# Altium schematic sheet QPL9547.SchDoc
size A4; Organization: Altium Limited; Address1: L3, 12a Rodborough Rd; Address2: Frenchs Forest; Address3: NSW; Address4: Australia 2086; DocumentNumber: 6; SheetNumber: 6; SheetTotal: 7
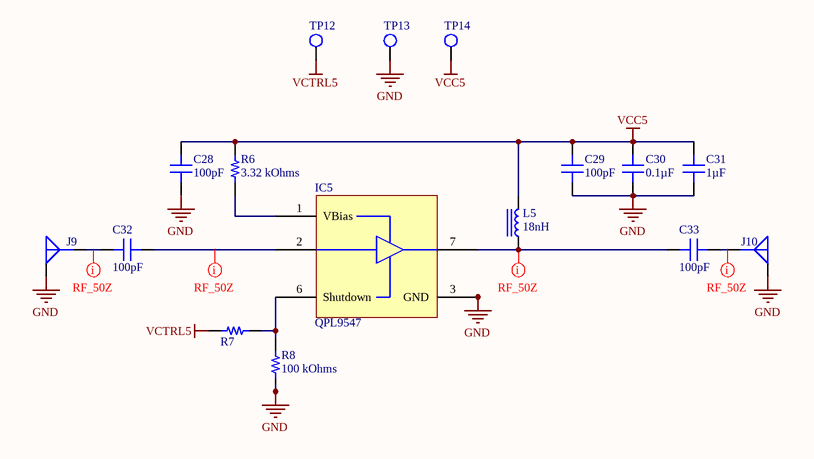
[diagram p0: QPL9547.SchDoc]

## Parts
C28  100pF  [CAP 0402_1005]
C29  100pF  [CAP 0402_1005]
C30  0.1µF  [CAP 0402_1005]
C31  1µF  [CAP 0402_1005]
C32  100pF  [CAP 0402_1005]
C33  100pF  [CAP 0402_1005]
IC5  QPL9547  [Qorvo LNA DFN-8 2X2]
J9  CON-SMA-EDGE-S  [CON-SMA-EDGE-S]  (value not drawn)
J10  CON-SMA-EDGE-S  [CON-SMA-EDGE-S]  (value not drawn)
L5  18nH  [0402CS]
R6  3.32 kOhms  [RES 0402_1005]
R7  (no value)  [RES 0402_1005]
R8  100 kOhms  [RES 0402_1005]
TP12  Test Point-THM  [KEYSTONE-THM-TestPoint]  (value not drawn)
TP13  Test Point-THM  [KEYSTONE-THM-TestPoint]  (value not drawn)
TP14  Test Point-THM  [KEYSTONE-THM-TestPoint]  (value not drawn)

## Nets
GND: C28.1 C29.1 C30.1 C31.1 IC5.3(GND) IC5.4(GND) IC5.5(GND) IC5.8(GND) IC5.9(GND) J9.2(G) J10.2(G) R8.1 TP13.1(TP)
VCC5: C28.2 C29.2 C30.2 C31.2 L5.2 R6.2 TP14.1(TP)
VCTRL5: R7.1 TP12.1(TP)
NetC32_1: C32.1 J9.1(S)
NetC32_2: C32.2 IC5.2(IN)
NetC33_1: C33.1 IC5.7(OUT) L5.1
NetC33_2: C33.2 J10.1(S)
NetIC5_1: IC5.1(VBias) R6.1
NetIC5_6: IC5.6(Shutdown) R7.2 R8.2

## Layout directives
net class RF_50Z: NetC32_1, NetC32_2, NetC33_1, NetC33_2

## Notes on the sheet
- Title
- Author:
- Murat Kucukyilmaz
- Number:
- Date:
- Sheet
- of

## Library data of the parts
C28 C29 C32 C33 = GCM1555C1H101FA16D: CAP CER 100PF 50V C0G/NP0 0402; Manufacturer: Murata Electronics; Temperature Coefficient: C0G, NP0; Tolerance: ±1%; Part Number: GCM1555C1H101FA16D; Value: 100pF; Applications: Automotive; Capacitance: 100pF; ComponentLink1Description: Datasheet; ComponentLink1URL: https://search.murata.co.jp/Ceramy/image/img/A01X/G101/ENG/GCM1555C1H101FA16-01.pdf; ComponentLink2Description: DigiKey Link; ComponentLink2URL: http://digikey.com/product-detail/en/murata-electronics/GCM1555C1H101FA16D/490-14349-1-ND/6606810; Device Package: 0402 (1005 Metric); LastUpdated: 2.09.2020 01:02:12; Lifecycle Status: Active; Minimum Order: 1; Mounting Type: Surface Mount, MLCC; Operating Temperature: -55°C ~ 125°C; Package / Case: 0402 (1005 Metric); Packaging: TapeAndReel; PartId: 7484; Part Status: Active; Price: 0.02; Ratings: AEC-Q200; Series: GCM; Size / Dimension: 0.039" L x 0.020" W (1.00mm x 0.50mm); Supplier 1: DigiKey; Supplier Part Number 1: 490-14349-1-ND; Thickness (Max): 0.022" (0.55mm); Voltage - Rated: 50V
C30 = EMK105B7104KV-F: CAP CER 0.1UF 16V X7R 0402; Manufacturer: Taiyo Yuden; Tolerance: ±10%; Part Number: EMK105B7104KV-F; Value: 0.1µF; Applications: General Purpose; Capacitance: 0.1µF; ComponentLink1Description: Datasheet; ComponentLink1URL: https://ds.yuden.co.jp/TYCOMPAS/ut/detail?pn=EMK105B7104KV-F  &u=M; ComponentLink2Description: DigiKey Link; ComponentLink2URL: http://digikey.com/product-detail/en/taiyo-yuden/EMK105B7104KV-F/587-1451-1-ND/1004082; Device Package: 0402 (1005 Metric); LastUpdated: 2.09.2020 01:02:15; Lifecycle Status: Active; Minimum Order: 1; Mounting Type: Surface Mount, MLCC; Operating Temperature: -55°C ~ 125°C; Package / Case: 0402 (1005 Metric); Packaging: CutTape; PartId: 6070; Part Status: Active; Price: 0.10; Series: M; Size / Dimension: 0.039" L x 0.020" W (1.00mm x 0.50mm); Supplier 1: DigiKey; Supplier Part Number 1: 587-1451-1-ND; Temperature Coefficient: X7R; Thickness (Max): 0.022" (0.55mm); Voltage - Rated: 16V
C31 = CL05A105KP5NNNC: CAP CER 1UF 10V X5R 0402; Manufacturer: Samsung Electro-Mechanics; Tolerance: ±10%; Part Number: CL05A105KP5NNNC; Value: 1µF; Applications: General Purpose; Capacitance: 1µF; ComponentLink1Description: Datasheet; ComponentLink1URL: http://www.samsungsem.com/kr/support/product-search/mlcc/CL05A105KP5NNNC.jsp; ComponentLink2Description: DigiKey Link; ComponentLink2URL: http://digikey.com/product-detail/en/samsung-electro-mechanics/CL05A105KP5NNNC/1276-1076-1-ND/3889162; Device Package: 0402 (1005 Metric); LastUpdated: 2.09.2020 01:02:21; Lifecycle Status: Active; Minimum Order: 1; Mounting Type: Surface Mount, MLCC; Operating Temperature: -55°C ~ 85°C; Package / Case: 0402 (1005 Metric); Packaging: TapeAndReel; PartId: 3103; Part Status: Active; Price: 0.01; Series: CL; Size / Dimension: 0.039" L x 0.020" W (1.00mm x 0.50mm); Supplier 1: DigiKey; Supplier Part Number 1: 1276-1076-1-ND; Temperature Coefficient: X5R; Thickness (Max): 0.022" (0.55mm); Voltage - Rated: 10V
IC5 = QPL9547: 0.1 -6 GHz Ultra Low-Noise LNA; Part Number: QPL9547; Supplier 1: Mouser; Supplier Part Number 1: 772-QPL9547SR
J9 J10 = CON-SMA-EDGE-S: CONN SMA JACK STR EDGE MNT; Part Number: CON-SMA-EDGE-S; Supplier 1: Digi-Key; Supplier 2: Mouser; Supplier Part Number 1: CON-SMA-EDGE-S-ND; Supplier Part Number 2: 223-CON-SMA-EDGE-S
L5 = 0402CS-18NXJLW: Fixed Inductors 1005 18nH Unshld 5% 420mA 230mOhms AECQ2; Value: 18nH; Supplier 1: Mouser; Supplier Part Number 1: 994-0402CS-18NXJLW
R6 = RC0402FR-073K32L: RES SMD 3.32K OHM 1% 1/16W 0402; Manufacturer: Yageo; Power (Watts): 0.063W, 1/16W; Temperature Coefficient: ±100ppm/°C; Part Number: RC0402FR-073K32L; Value: 3.32 kOhms; ComponentLink1Description: Datasheet; ComponentLink1URL: https://www.yageo.com/upload/media/product/productsearch/datasheet/rchip/PYu-RC_Group_51_RoHS_L_10.pdf; ComponentLink2Description: DigiKey Link; ComponentLink2URL: http://digikey.com/product-detail/en/yageo/RC0402FR-073K32L/311-3.32KLRCT-ND/2827944; Composition: Thick Film; Device Package: 0402 (1005 Metric); Features: Moisture Resistant; Height - Seated (Max): 0.016" (0.40mm); LastUpdated: 2.09.2020 01:07:35; Lifecycle Status: Active; Minimum Order: 1; Number of Terminations: 2; Operating Temperature: -55°C ~ 155°C; Package / Case: 0402 (1005 Metric); Packaging: CutTape; PartId: 17991; Part Status: Active; Price: 0.10; Resistance: 3.32 kOhms; Series: RC; Size / Dimension: 0.039" L x 0.020" W (1.00mm x 0.50mm); Supplier 1: DigiKey; Supplier Part Number 1: 311-3.32KLRCT-ND; Supplier Device Package: 0402; Tolerance: ±1%
R7 = RC0402JR-070RP: RES SMD 0 OHM JUMPER 1/16W 0402; Manufacturer: Yageo; Power (Watts): 0.063W, 1/16W; Part Number: RC0402JR-070RP; ComponentLink1Description: Datasheet; ComponentLink1URL: http://www.yageo.com/NewPortal/yageodocoutput?fileName=/pdf/R-Chip/PYu-RC_51_RoHS_P_0.pdf; ComponentLink2Description: DigiKey Link; ComponentLink2URL: http://digikey.com/product-detail/en/yageo/RC0402JR-070RP/YAG1279CT-ND/4935394; Composition: Thick Film; Device Package: 0402 (1005 Metric); Features: Moisture Resistant; Height - Seated (Max): 0.016" (0.40mm); LastUpdated: 2.09.2020 01:07:33; Lifecycle Status: Active; Minimum Order: 1; Number of Terminations: 2; Operating Temperature: -55°C ~ 155°C; Package / Case: 0402 (1005 Metric); Packaging: CutTape; PartId: 18920; Part Status: Active; Price: 0.10; Series: RC-P Lead Free; Size / Dimension: 0.039" L x 0.020" W (1.00mm x 0.50mm); Supplier 1: DigiKey; Supplier Part Number 1: YAG1279CT-ND; Supplier Device Package: 0402; Tolerance: Jumper
R8 = ERJ-2GEJ104X: RES SMD 100K OHM 5% 1/10W 0402; Manufacturer: Panasonic Electronic Components; Power (Watts): 0.1W, 1/10W; Temperature Coefficient: ±200ppm/°C; Part Number: ERJ-2GEJ104X; Value: 100 kOhms; ComponentLink1Description: Datasheet; ComponentLink1URL: https://b2b-api.panasonic.eu/file_stream/pids/fileversion/1242; ComponentLink2Description: DigiKey Link; ComponentLink2URL: http://digikey.com/product-detail/en/panasonic-electronic-components/ERJ-2GEJ104X/P100KJCT-ND/146730; Composition: Thick Film; Device Package: 0402 (1005 Metric); Features: Automotive AEC-Q200; Height - Seated (Max): 0.016" (0.40mm); LastUpdated: 2.09.2020 01:07:36; Lifecycle Status: Active; Minimum Order: 1; Number of Terminations: 2; Operating Temperature: -55°C ~ 155°C; Package / Case: 0402 (1005 Metric); Packaging: CutTape; PartId: 17613; Part Status: Active; Price: 0.10; Ratings: AEC-Q200; Resistance: 100 kOhms; Series: ERJ; Size / Dimension: 0.039" L x 0.020" W (1.00mm x 0.50mm); Supplier 1: DigiKey; Supplier Part Number 1: P100KJCT-ND; Supplier Device Package: 0402; Tolerance: ±5%
TP12-TP14 = Test Point-THM: THRU HOLE MOUNT TEST POINTS; Supplier 1: Digi-Key; Supplier 2: Mouser; Supplier Part Number 1: 36-5012-ND; Supplier Part Number 2: 534-5012